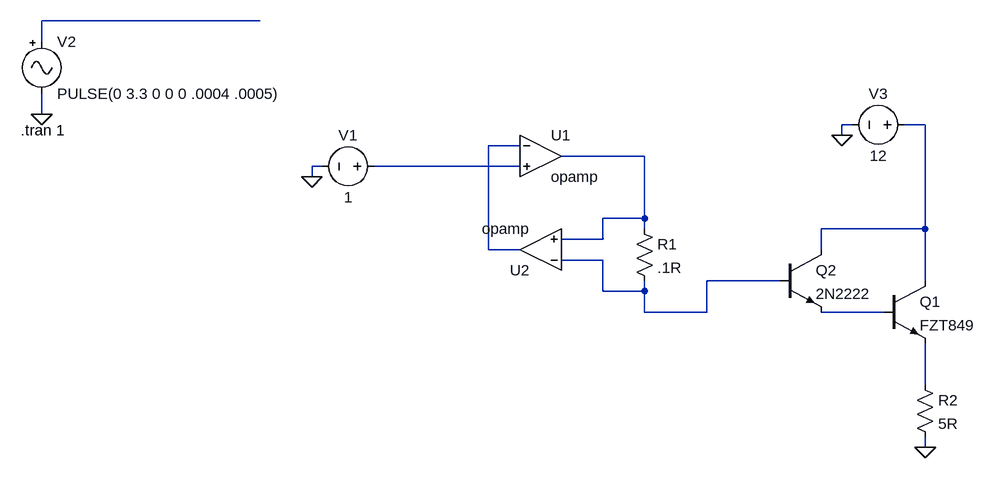
[diagram p0: schematic Diff_Amp.asc]
Diff_Amp.asc, the LTspice schematic file:
Version 4
SHEET 1 1432 680
WIRE 256 -144 -80 -144
WIRE -80 -112 -80 -144
WIRE -80 0 -80 -32
WIRE 1168 16 1152 16
WIRE 1280 16 1248 16
WIRE 1152 32 1152 16
WIRE 656 48 608 48
WIRE 848 64 720 64
WIRE 352 80 336 80
WIRE 656 80 432 80
WIRE 336 96 336 80
WIRE 848 160 848 64
WIRE 848 160 784 160
WIRE 848 176 848 160
WIRE 1280 176 1280 16
WIRE 1280 176 1120 176
WIRE 784 192 784 160
WIRE 784 192 720 192
WIRE 608 208 608 48
WIRE 656 208 608 208
WIRE 1120 208 1120 176
WIRE 784 224 720 224
WIRE 1056 256 944 256
WIRE 1280 256 1280 176
WIRE 784 272 784 224
WIRE 848 272 848 256
WIRE 848 272 784 272
WIRE 848 304 848 272
WIRE 944 304 944 256
WIRE 944 304 848 304
WIRE 1216 304 1120 304
WIRE 1280 416 1280 352
WIRE 1280 512 1280 496
FLAG -80 0 0
FLAG 1280 512 0
FLAG 336 96 0
FLAG 1152 32 0
SYMBOL Misc\\signal -80 -128 R0
WINDOW 123 0 0 Left 0
WINDOW 39 0 0 Left 0
SYMATTR InstName V2
SYMATTR Value PULSE(0 3.3 0 0 0 .0004 .0005)
SYMBOL npn 1216 256 R0
SYMATTR InstName Q1
SYMATTR Value FZT849
SYMBOL OpAmps\\opamp 688 0 R0
SYMATTR InstName U1
SYMBOL res 832 160 R0
SYMATTR InstName R1
SYMATTR Value .1R
SYMBOL OpAmps\\opamp 688 272 R180
SYMATTR InstName U2
SYMBOL res 1264 400 R0
SYMATTR InstName R2
SYMATTR Value 5R
SYMBOL voltage 448 80 R90
WINDOW 0 -32 56 VBottom 2
WINDOW 3 32 56 VTop 2
WINDOW 123 0 0 Left 0
WINDOW 39 0 0 Left 0
SYMATTR InstName V1
SYMATTR Value 1
SYMBOL voltage 1264 16 R90
WINDOW 0 -32 56 VBottom 2
WINDOW 3 32 56 VTop 2
WINDOW 123 0 0 Left 0
WINDOW 39 0 0 Left 0
SYMATTR InstName V3
SYMATTR Value 12
SYMBOL npn 1056 208 R0
SYMATTR InstName Q2
SYMATTR Value 2N2222
TEXT -112 24 Left 2 !.tran 1

The netlist it stands for:
* Diff_Amp.asc
V2 N001 0 PULSE(0 3.3 0 0 0 .0004 .0005)
Q1 N002 N007 N008 0 FZT849
XU1 N003 N005 N004 opamp Aol=100K GBW=10Meg  ; pins invin noninvin out
R1 N004 N006 .1R
XU2 N006 N004 N003 opamp Aol=100K GBW=10Meg  ; pins invin noninvin out
R2 N008 0 5R
V1 N005 0 1
V3 N002 0 12
Q2 N002 N006 N007 0 2N2222
.model NPN NPN
.model PNP PNP
.lib standard.bjt
.tran 1
.backanno
.end